# EAGLE design programmer-shield (EAGLE 6.5.0)
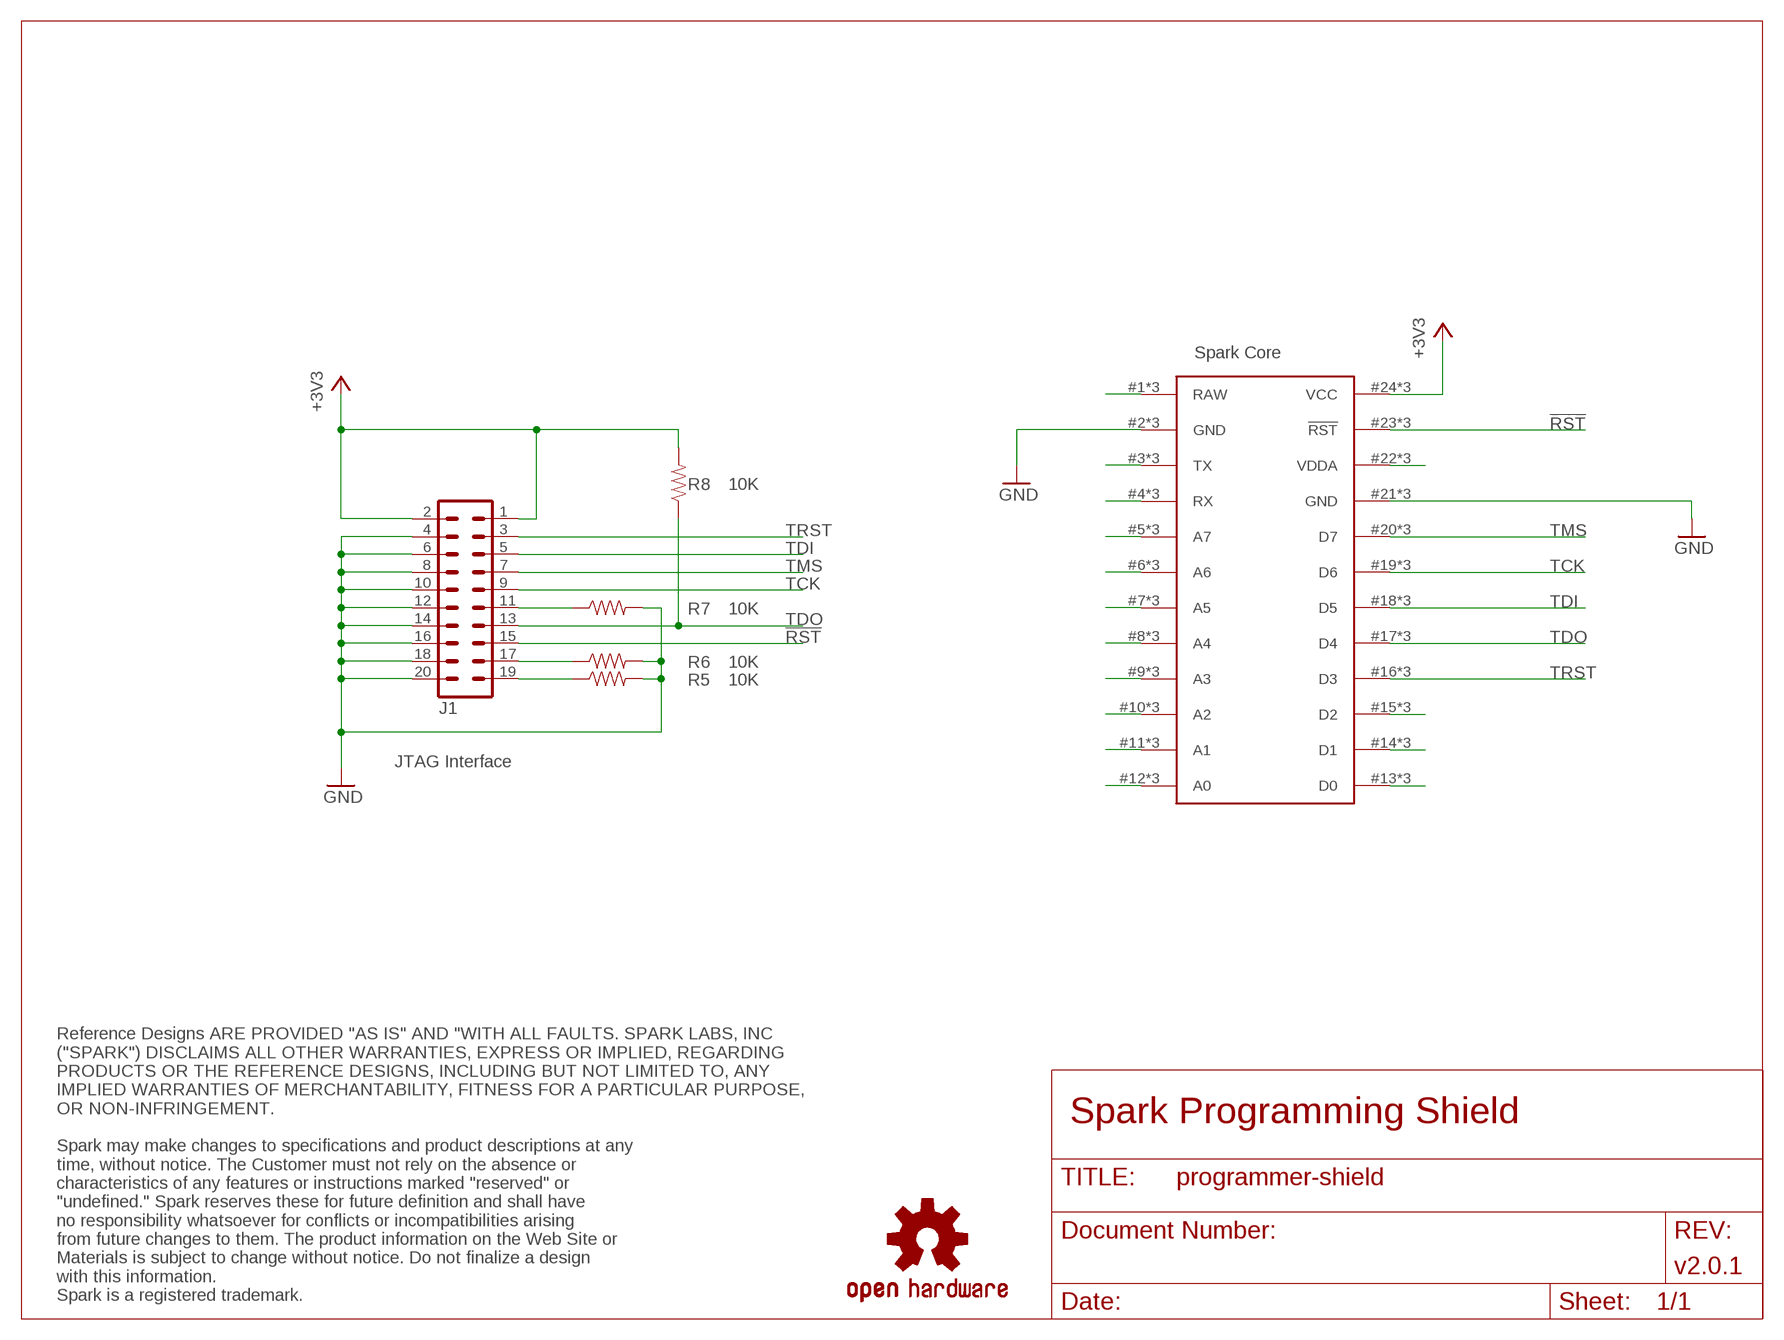
[diagram p0: schematic, sheet 1]

## Parts
J1  ML20  [ML20]
LOGO1  OSHW-LOGOM  [OSHW-LOGO-M]
R5  10K  RESISTORAXIAL-0.3  [AXIAL-0.3]
R6  10K  RESISTORAXIAL-0.3  [AXIAL-0.3]
R7  10K  RESISTORAXIAL-0.3  [AXIAL-0.3]
R8  10K  RESISTORAXIAL-0.3  [AXIAL-0.3]
U$1  SPARK_CORE  [SPARK_CORE_STACKABLE]

## Nets
!RST: J1.15 U$1.23(!RST) U$1.#23(!RST) U$1.@23(!RST)
+3V3: J1.1 J1.2 R8.P$2 U$1.24(VCC) U$1.#24(VCC) U$1.@24(VCC)
GND: J1.4 J1.6 J1.8 J1.10 J1.12 J1.14 J1.16 J1.18 J1.20 R5.P$2 R6.P$2 R7.P$2 U$1.2(GND) U$1.21(GND) U$1.#2(GND) U$1.#21(GND) U$1.@2(GND) U$1.@21(GND)
N$1: U$1.1(RAW) U$1.#1(RAW) U$1.@1(RAW)
N$2: U$1.3(TX) U$1.#3(TX) U$1.@3(TX)
N$3: U$1.4(RX) U$1.#4(RX) U$1.@4(RX)
N$4: U$1.5(A7) U$1.#5(A7) U$1.@5(A7)
N$5: U$1.6(A6) U$1.#6(A6) U$1.@6(A6)
N$6: U$1.7(A5) U$1.#7(A5) U$1.@7(A5)
N$7: U$1.8(A4) U$1.#8(A4) U$1.@8(A4)
N$8: U$1.9(A3) U$1.#9(A3) U$1.@9(A3)
N$9: U$1.10(A2) U$1.#10(A2) U$1.@10(A2)
N$10: U$1.11(A1) U$1.#11(A1) U$1.@11(A1)
N$11: U$1.12(A0) U$1.#12(A0) U$1.@12(A0)
N$12: U$1.13(D0) U$1.#13(D0) U$1.@13(D0)
N$13: J1.19 R5.P$1
N$14: J1.17 R6.P$1
N$15: J1.11 R7.P$1
N$16: U$1.14(D1) U$1.#14(D1) U$1.@14(D1)
N$17: U$1.15(D2) U$1.#15(D2) U$1.@15(D2)
N$18: U$1.22(VDDA) U$1.#22(VDDA) U$1.@22(VDDA)
TCK: J1.9 U$1.19(D6) U$1.#19(D6) U$1.@19(D6)
TDI: J1.5 U$1.18(D5) U$1.#18(D5) U$1.@18(D5)
TDO: J1.13 R8.P$1 U$1.17(D4) U$1.#17(D4) U$1.@17(D4)
TMS: J1.7 U$1.20(D7) U$1.#20(D7) U$1.@20(D7)
TRST: J1.3 U$1.16(D3) U$1.#16(D3) U$1.@16(D3)

## Notes on the sheet
- Spark Core
- JTAG Interface
- Spark Programming Shield
- v2.0.1
- Reference Designs ARE PROVIDED "AS IS" AND "WITH ALL FAULTS. SPARK LABS, INC 
  ("SPARK") DISCLAIMS ALL OTHER WARRANTIES, EXPRESS OR IMPLIED, REGARDING 
  PRODUCTS OR THE REFERENCE DESIGNS, INCLUDING BUT NOT LIMITED TO, ANY 
  IMPLIED WARRANTIES OF MERCHANTABILITY, FITNESS FOR A PARTICULAR PURPOSE,
  OR NON-INFRINGEMENT.
  
  Spark may make changes to specifications and product descriptions at any 
  time, without notice. The Customer must not rely on the absence or 
  characteristics of any features or instructions marked "reserved" or 
  "undefined." Spark reserves these for future definition and shall have 
  no responsibility whatsoever for conflicts or incompatibilities arising 
  from future changes to them. The product information on the Web Site or 
  Materials is subject to change without notice. Do not finalize a design 
  with this information. 
  Spark is a registered trademark.

## Library data of the parts
J1 = con-harting-ml:ML20: HARTING
LOGO1 = Spark:OSHW-LOGO: Open Source Hardware Logo This logo indicates the piece of hardware it is found on incorporates a OSHW license and/or adheres to the definition of open source hardware found here: http://freedomdefined.org/OSHW
R5-R8 = SparkFun-Passives:RESISTOR: Resistor Basic schematic elements and footprints for 0603, 1206, and PTH resistors.
U$1 = Spark:SPARK_CORE

## Board
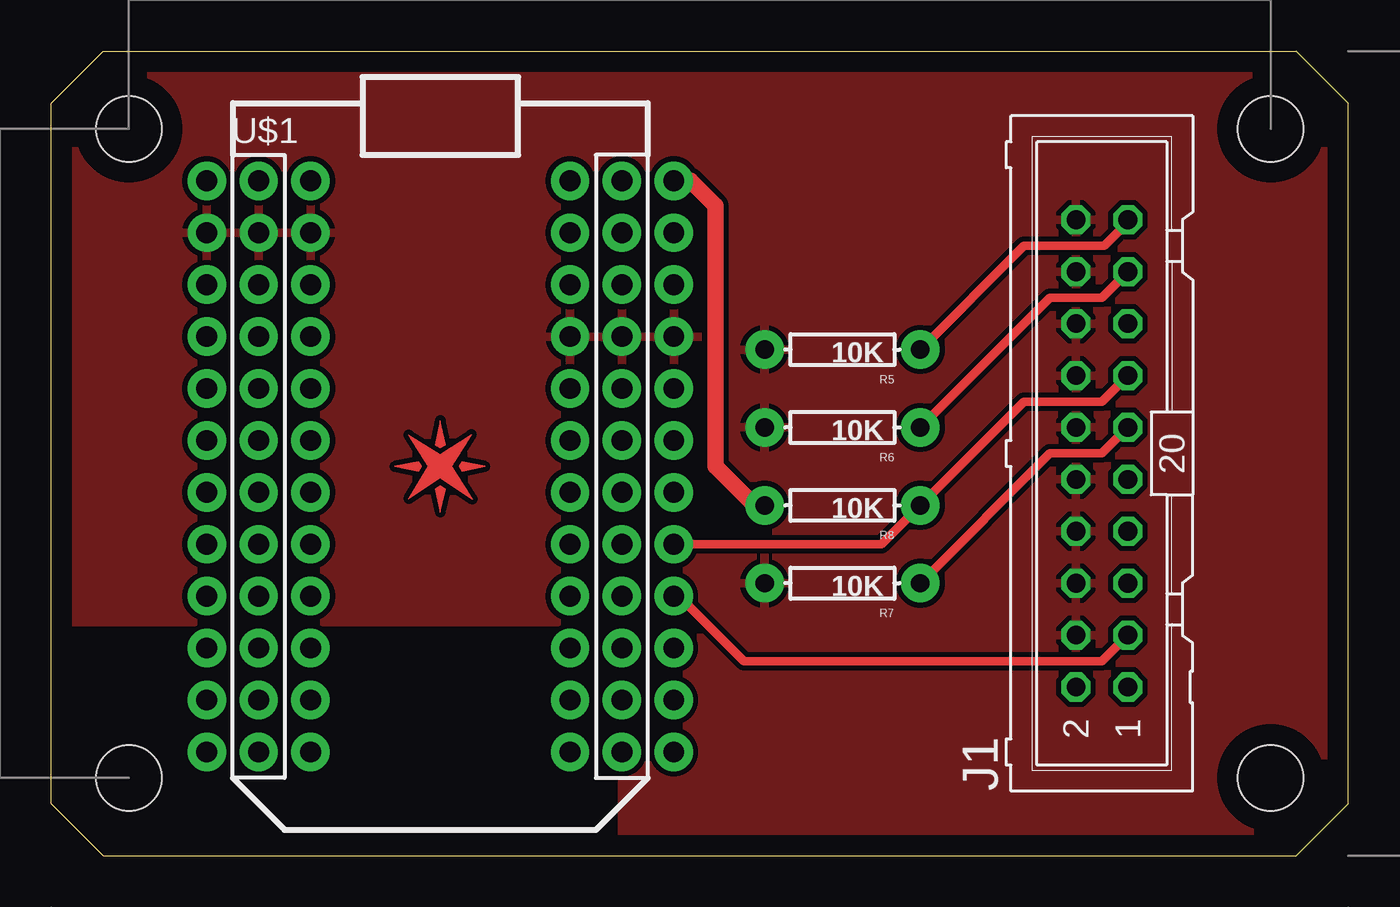
[diagram p1: board, top side]
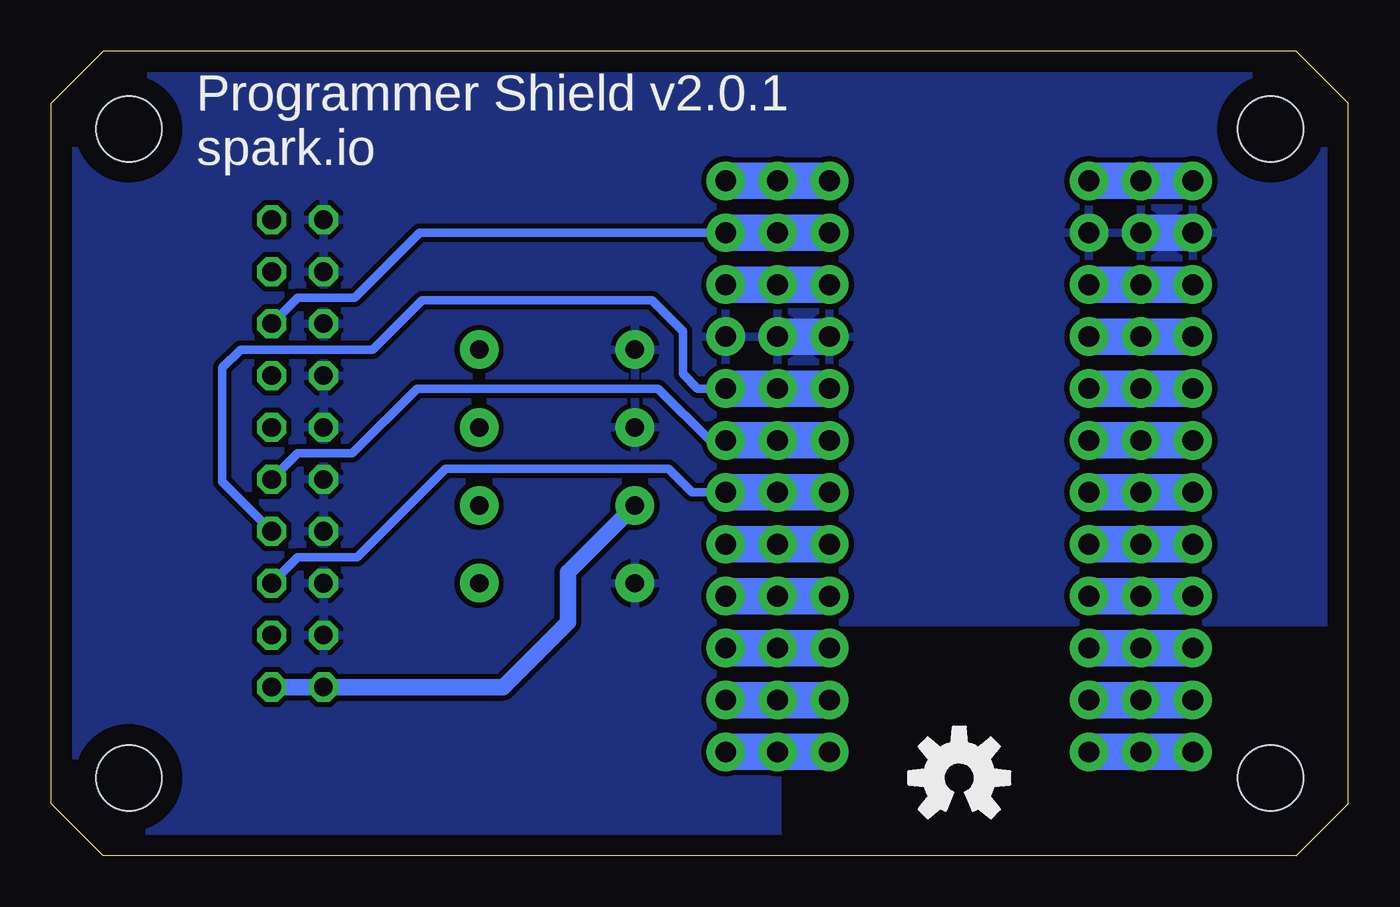
[diagram p2: board, bottom side, seen from below]

Size 63.5 x 39.37 mm. Coordinates in mm from the lower left corner, seen from the top.
Outline: 2.54,0 0,2.54 0,36.83 2.54,39.37 60.96,39.37 63.5,36.83 63.5,2.54 60.96,0 2.54,0
Copper layers (1*16): Top 0.035mm / dielectric 1.5mm / Bottom 0.035mm
Design rules "default *": minimum track width 10mil, minimum drill 0.3mm, track to track 10mil, track to pad 10mil, pad to pad 10mil, via to via 10mil, smd to smd 10mil, copper to edge 40mil, drill to drill 8mil, minimum pad ring 10mil, minimum via ring 8mil, stop-mask expansion 4mil, vias tented up to drill 0mil, thermal gap 10mil
Holes 3.2 mm at 59.69,35.56 59.69,3.81 3.81,3.81 3.81,35.56

### Footprints (pad centres in the part's own frame; a part is rotated, then mirrored left to right if it is on the bottom)
ML20 = drill 0.914 octagon: 1 -11.43,-1.27; 2 -11.43,1.27; 3 -8.89,-1.27; 4 -8.89,1.27; 5 -6.35,-1.27; 6 -6.35,1.27; 7 -3.81,-1.27; 8 -3.81,1.27; 9 -1.27,-1.27; 10 -1.27,1.27; 11 1.27,-1.27; 12 1.27,1.27; 13 3.81,-1.27; 14 3.81,1.27; 15 6.35,-1.27; 16 6.35,1.27; 17 8.89,-1.27; 18 8.89,1.27; 19 11.43,-1.27; 20 11.43,1.27
AXIAL-0.3 = drill 0.9 pad 1.88: P$1 -3.81,0; P$2 3.81,0
SPARK_CORE_STACKABLE = drill 1.016 pad 1.88: 1 -8.89,13.97; 2 -8.89,11.43; 3 -8.89,8.89; 4 -8.89,6.35; 5 -8.89,3.81; 6 -8.89,1.27; 7 -8.89,-1.27; 8 -8.89,-3.81; 9 -8.89,-6.35; 10 -8.89,-8.89; 11 -8.89,-11.43; 12 -8.89,-13.97; 13 8.89,-13.97; 14 8.89,-11.43; 15 8.89,-8.89; 16 8.89,-6.35; 17 8.89,-3.81; 18 8.89,-1.27; 19 8.89,1.27; 20 8.89,3.81; 21 8.89,6.35; 22 8.89,8.89; 23 8.89,11.43; 24 8.89,13.97; #1 -6.35,13.97; #2 -6.35,11.43; #3 -6.35,8.89; #4 -6.35,6.35; #5 -6.35,3.81; #6 -6.35,1.27; #7 -6.35,-1.27; #8 -6.35,-3.81; #9 -6.35,-6.35; #10 -6.35,-8.89; #11 -6.35,-11.43; #12 -6.35,-13.97; #13 11.43,-13.97; #14 11.43,-11.43; #15 11.43,-8.89; #16 11.43,-6.35; #17 11.43,-3.81; #18 11.43,-1.27; #19 11.43,1.27; #20 11.43,3.81; #21 11.43,6.35; #22 11.43,8.89; #23 11.43,11.43; #24 11.43,13.97; @1 -11.43,13.97; @2 -11.43,11.43; @3 -11.43,8.89; @4 -11.43,6.35; @5 -11.43,3.81; @6 -11.43,1.27; @7 -11.43,-1.27; @8 -11.43,-3.81; @9 -11.43,-6.35; @10 -11.43,-8.89; @11 -11.43,-11.43; @12 -11.43,-13.97; @13 6.35,-13.97; @14 6.35,-11.43; @15 6.35,-8.89; @16 6.35,-6.35; @17 6.35,-3.81; @18 6.35,-1.27; @19 6.35,1.27; @20 6.35,3.81; @21 6.35,6.35; @22 6.35,8.89; @23 6.35,11.43; @24 6.35,13.97

### Placement (x,y rotation side)
E$1  [SPARK_LOGO_PLUS_PLANE]  19.05,19.05 0 top
J1  51.44,19.68 90 top
LOGO1  19.05,3.81 0 bottom
R5  38.73,24.77 180 top
R6  38.73,20.95 180 top
R7  38.73,13.34 180 top
R8  38.73,17.14 180 top
U$1  19.05,19.05 0 top

### Tracks (layer width: path | path; a pad name or v marks a point on that pad's centre or on a via)
!RST
  Bottom 0.406: U$1.#23 45.47,30.48 48.64,27.3 51.44,27.3 J1.15
  Bottom 1.778: U$1.@23 U$1.23 U$1.#23
+3V3
  Top 0.813: R8.P$2 34.42,17.14 32.51,19.05 32.51,31.8 31.29,33.02 U$1.#24
  Bottom 0.813: J1.1 J1.2 41.38,8.26 38.2,11.43 38.2,13.87 R8.P$2
  Bottom 1.778: U$1.@24 U$1.24 U$1.#24
GND
  Bottom 1.778: U$1.@2 U$1.2 | U$1.@21 U$1.21
  pour Bottom: 0,11.43 27.94,11.43 27.94,0 63.5,0 63.5,39.37 0,39.37
  pour Top: 0,11.43 0,39.37 63.5,39.37 63.5,0 27.94,0 27.94,11.43
N$1
  Bottom 1.778: U$1.@1 U$1.1 U$1.#1
N$2
  Bottom 1.778: U$1.#3 U$1.3 U$1.@3
N$3
  Bottom 1.778: U$1.@4 U$1.4 U$1.#4
N$4
  Bottom 1.778: U$1.@5 U$1.5 U$1.#5
N$5
  Bottom 1.778: U$1.@6 U$1.6 U$1.#6
N$6
  Bottom 1.778: U$1.@7 U$1.7 U$1.#7
N$7
  Bottom 1.778: U$1.@8 U$1.8 U$1.#8
N$8
  Bottom 1.778: U$1.@9 U$1.9 U$1.#9
N$9
  Bottom 1.778: U$1.@10 U$1.10 U$1.#10
N$10
  Bottom 1.778: U$1.@11 U$1.11 U$1.#11
N$11
  Bottom 1.778: U$1.@12 U$1.12 U$1.#12
N$12
  Bottom 1.778: U$1.@13 U$1.13 U$1.#13
N$13
  Top 0.406: J1.19 52.7,30.99 51.56,29.84 47.62,29.84 R5.P$1
N$14
  Top 0.406: J1.17 51.44,27.3 48.9,27.3 R6.P$1
N$15
  Top 0.406: J1.11 51.44,19.68 48.9,19.68 R7.P$1
N$16
  Bottom 1.778: U$1.@14 U$1.14 U$1.#14
N$17
  Bottom 1.778: U$1.@15 U$1.15 U$1.#15
N$18
  Bottom 1.778: U$1.@22 U$1.22 U$1.#22
TCK
  Bottom 0.406: U$1.#19 31.24,20.32 33.78,22.86 45.59,22.86 48.77,19.68 51.44,19.68 J1.9
  Bottom 1.778: U$1.@19 U$1.19 U$1.#19
TDI
  Bottom 0.406: U$1.#18 32.13,17.78 33.27,18.92 44.2,18.92 48.51,14.61 51.44,14.61 J1.5
  Bottom 1.778: U$1.@18 U$1.18 U$1.#18
TDO
  Top 0.406: J1.13 51.44,22.23 47.62,22.23 R8.P$1 40.64,15.24 U$1.#17
  Bottom 1.778: U$1.@17 U$1.17 U$1.#17
TMS
  Bottom 0.406: U$1.20 30.02,22.86 | J1.7 55.12,18.29 55.12,23.88 54.23,24.77 47.75,24.77 45.34,27.18 34.09,27.18 32.56,25.65 32.56,23.57 31.85,22.86 U$1.#20
  Bottom 1.778: U$1.@20 U$1.20 | 27.94,22.91 27.99,22.86 30.02,22.86 U$1.#20
TRST
  Top 0.406: J1.3 51.44,9.53 33.91,9.53 30.73,12.7 U$1.#16
  Bottom 1.778: U$1.@16 U$1.16 U$1.#16

### Text on the board
bPlace: Programmer Shield v2.0.1 / spark.io
tDocu: Reference Designs ARE PROVIDED "AS IS" AND "WITH ALL FAULTS. SPARK LABS, INC / ("SPARK") DISCLAIMS ALL OTHER WARRANTIES, EXPRESS OR IMPLIED, REGARDING / PRODUCTS OR THE REFERENCE DESIGNS, INCLUDING BUT NOT LIMITED TO, ANY / IMPLIED WARRANTIES OF MERCHANTABILITY, FITNESS FOR A PARTICULAR PURPOSE, / OR NON-INFRINGEMENT. / / Spark may make changes to specifications and product descriptions at any / time, without notice. The Customer must not rely on the absence or / characteristics of any features or instructions marked "reserved" or / "undefined." Spark reserves these for future definition and shall have / no responsibility whatsoever for conflicts or incompatibilities arising / from future changes to them. The product information on the Web Site or / Materials is subject to change without notice. Do not finalize a design / with this information. / Spark is a registered trademark.